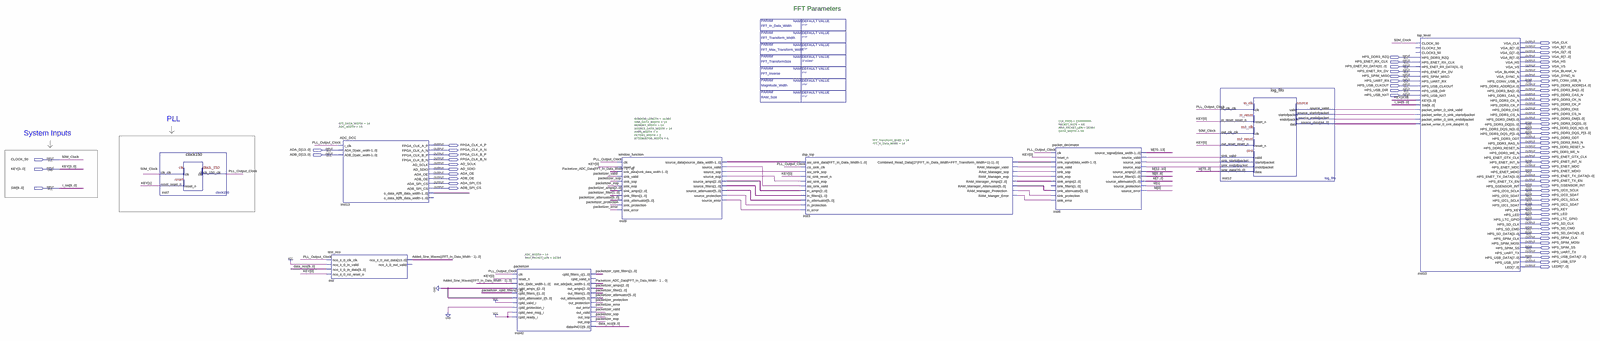
[diagram p0: schematic sheet, whole]
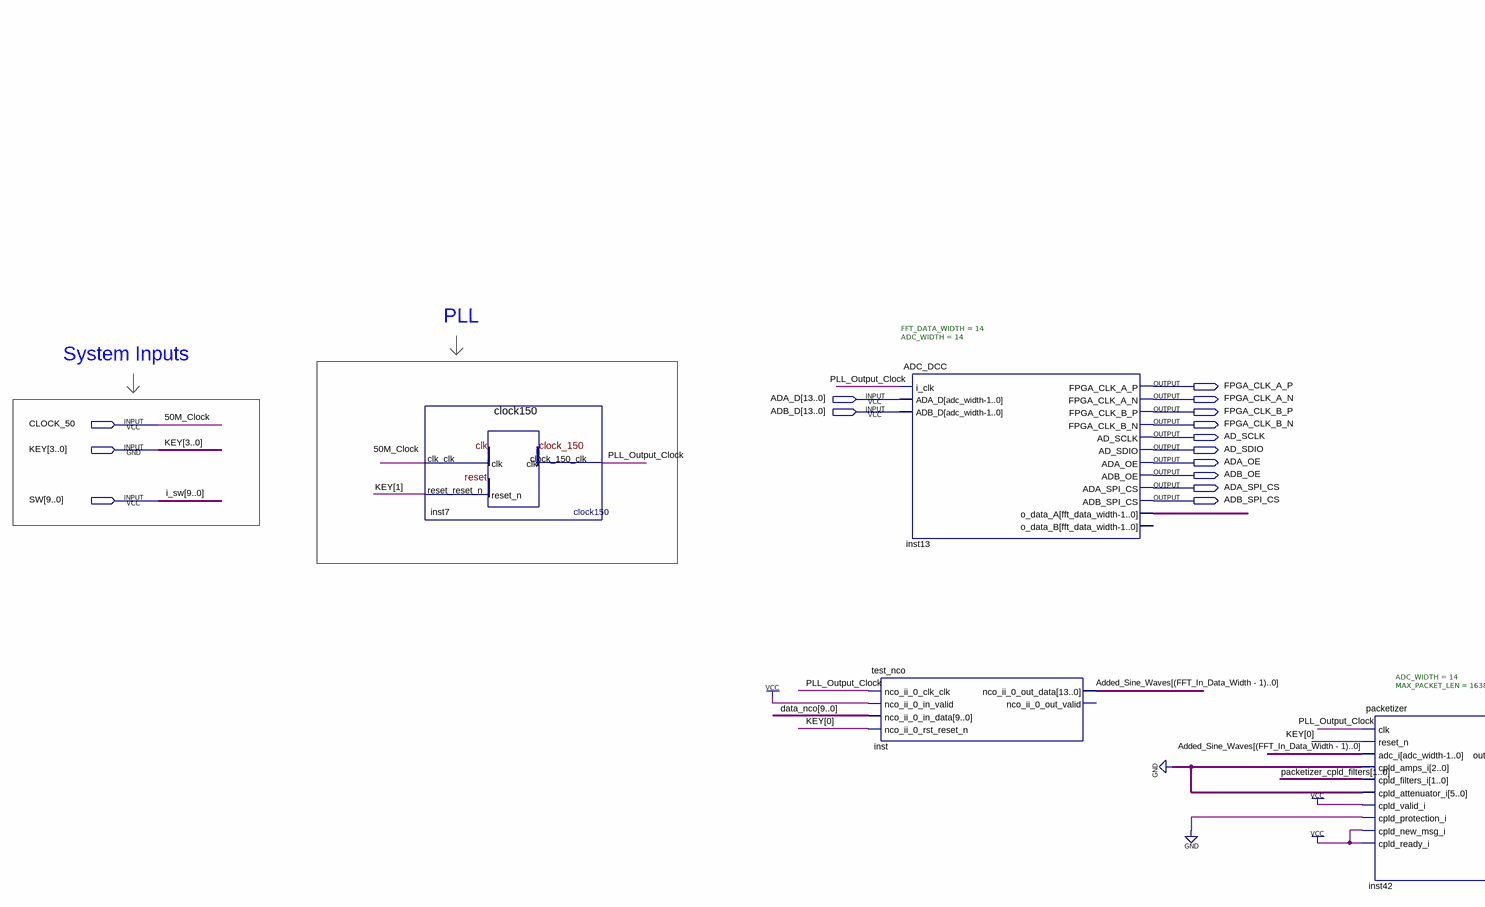
[diagram p1: schematic sheet, left part]
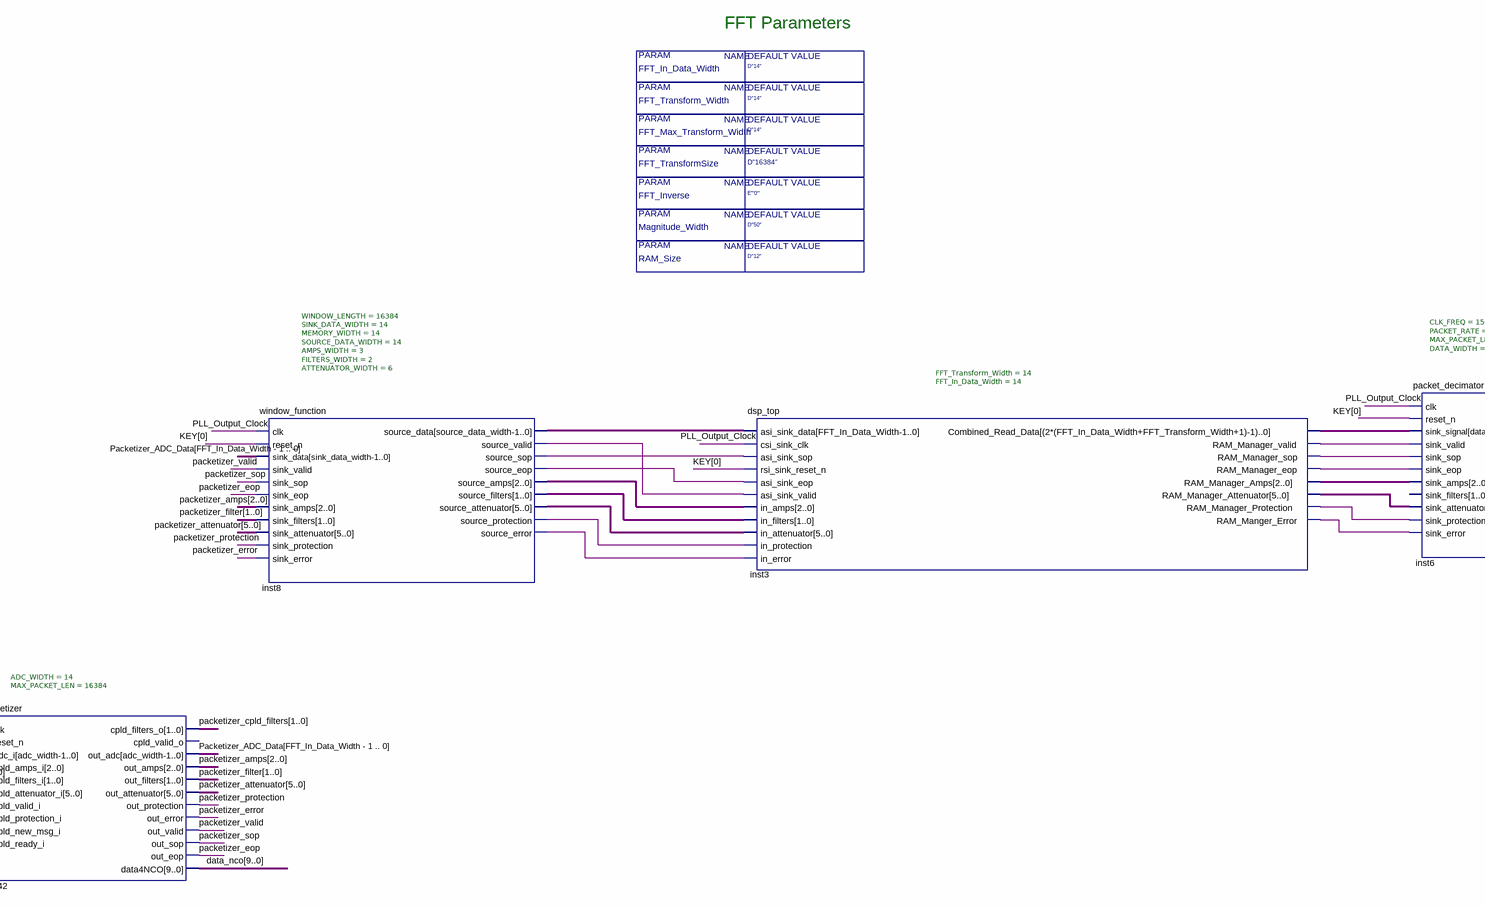
[diagram p2: schematic sheet, centre part]
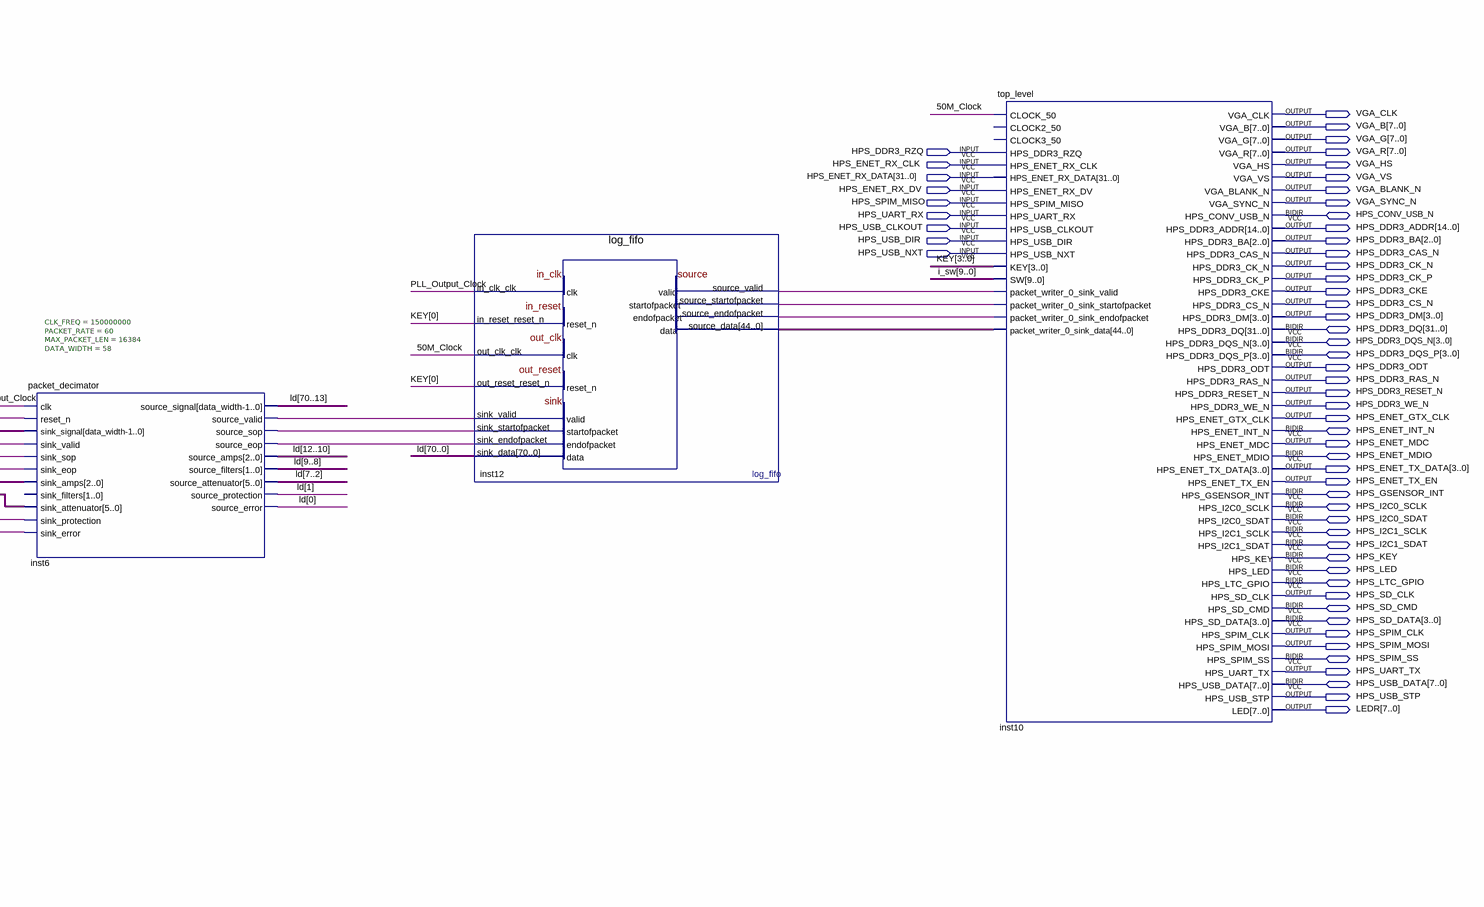
[diagram p3: schematic sheet, right part]
// Quartus schematic dsp_window.bdf as structural Verilog: 9 symbols, 72 pins
module dsp_window #(parameter FFT_Inverse = "E\"'0'\"", parameter RAM_Size = "D\"12\"", parameter FFT_In_Data_Width = "D\"14\"", parameter Magnitude_Width = "D\"50\"", parameter FFT_TransformSize = "D\"16384\"", parameter FFT_Transform_Width = "D\"14\"", parameter FFT_Max_Transform_Width = "D\"14\"") (
  input  HPS_DDR3_RZQ,
  input  HPS_ENET_RX_CLK,
  input  [31:0] HPS_ENET_RX_DATA,
  input  HPS_ENET_RX_DV,
  input  HPS_SPIM_MISO,
  input  HPS_UART_RX,
  input  HPS_USB_CLKOUT,
  input  HPS_USB_DIR,
  input  HPS_USB_NXT,
  input  [13:0] ADA_D,
  input  [13:0] ADB_D,
  input  CLOCK_50,
  input  [3:0] KEY,
  input  [9:0] SW,
  inout  HPS_CONV_USB_N,
  inout  [31:0] HPS_DDR3_DQ,
  inout  [3:0] HPS_DDR3_DQS_N,
  inout  [3:0] HPS_DDR3_DQS_P,
  inout  HPS_ENET_INT_N,
  inout  HPS_ENET_MDIO,
  inout  HPS_GSENSOR_INT,
  inout  HPS_I2C0_SCLK,
  inout  HPS_I2C0_SDAT,
  inout  HPS_I2C1_SCLK,
  inout  HPS_I2C1_SDAT,
  inout  HPS_KEY,
  inout  HPS_LED,
  inout  HPS_LTC_GPIO,
  inout  HPS_SD_CMD,
  inout  [3:0] HPS_SD_DATA,
  inout  HPS_SPIM_SS,
  inout  [7:0] HPS_USB_DATA,
  output VGA_CLK,
  output [7:0] VGA_B,
  output [7:0] VGA_G,
  output [7:0] VGA_R,
  output VGA_HS,
  output VGA_VS,
  output VGA_BLANK_N,
  output VGA_SYNC_N,
  output [14:0] HPS_DDR3_ADDR,
  output [2:0] HPS_DDR3_BA,
  output HPS_DDR3_CAS_N,
  output HPS_DDR3_CK_N,
  output HPS_DDR3_CK_P,
  output HPS_DDR3_CKE,
  output HPS_DDR3_CS_N,
  output [3:0] HPS_DDR3_DM,
  output HPS_DDR3_ODT,
  output HPS_DDR3_RAS_N,
  output FPGA_CLK_A_P,
  output HPS_DDR3_RESET_N,
  output FPGA_CLK_A_N,
  output HPS_DDR3_WE_N,
  output FPGA_CLK_B_P,
  output HPS_ENET_GTX_CLK,
  output FPGA_CLK_B_N,
  output AD_SCLK,
  output HPS_ENET_MDC,
  output AD_SDIO,
  output ADA_OE,
  output [3:0] HPS_ENET_TX_DATA,
  output ADB_OE,
  output HPS_ENET_TX_EN,
  output ADA_SPI_CS,
  output ADB_SPI_CS,
  output HPS_SD_CLK,
  output HPS_SPIM_CLK,
  output HPS_SPIM_MOSI,
  output HPS_UART_TX,
  output HPS_USB_STP,
  output [7:0] LEDR
);

  wire \Added_Sine_Waves[(FFT_In_Data_Width_-_1)..0] , inst3_ram_manager_eop, inst3_ram_manager_protection,
       inst3_ram_manager_sop, inst3_ram_manager_valid, inst3_ram_manger_error, inst6_source_eop,
       inst6_source_sop, inst6_source_valid, inst8_source_eop, inst8_source_error, inst8_source_protection,
       inst8_source_sop, inst8_source_valid, inst12_source_endofpacket, inst12_source_startofpacket,
       inst12_source_valid, \Packetizer_ADC_Data[FFT_In_Data_Width_-_1_.._0] , packetizer_eop,
       packetizer_error, packetizer_protection, packetizer_sop, packetizer_valid, PLL_Output_Clock;
  wire [1:0] inst8_source_filters, packetizer_cpld_filters, packetizer_filter;
  wire [2:0] inst3_ram_manager_amps, inst8_source_amps, packetizer_amps;
  wire [5:0] inst3_ram_manager_attenuator, inst8_source_attenuator, packetizer_attenuator;
  wire [9:0] data_nco;
  wire [13:0] inst8_source_data, inst13_o_data_a;
  wire [44:0] inst12_source_data;
  wire [57:0] inst3_combined_read_data;
  wire [70:0] ld;

  clock150 inst7 (.clk_clk(CLOCK_50), .reset_reset_n(KEY[1]), .clock_150_clk(PLL_Output_Clock));
  ADC_DCC #(.FFT_DATA_WIDTH(14), .ADC_WIDTH(14)) inst13 (
    .i_clk(PLL_Output_Clock), .ADA_D(ADA_D), .ADB_D(ADB_D), .FPGA_CLK_A_P(FPGA_CLK_A_P),
    .FPGA_CLK_A_N(FPGA_CLK_A_N), .FPGA_CLK_B_P(FPGA_CLK_B_P), .FPGA_CLK_B_N(FPGA_CLK_B_N), .AD_SCLK(AD_SCLK),
    .AD_SDIO(AD_SDIO), .ADA_OE(ADA_OE), .ADB_OE(ADB_OE), .ADA_SPI_CS(ADA_SPI_CS), .ADB_SPI_CS(ADB_SPI_CS),
    .o_data_A(inst13_o_data_a));  // open: o_data_B
  test_nco inst (
    .nco_ii_0_clk_clk(PLL_Output_Clock), .nco_ii_0_in_valid(1'b1), .nco_ii_0_in_data(data_nco),
    .nco_ii_0_rst_reset_n(KEY[0]), .nco_ii_0_out_data(\Added_Sine_Waves[(FFT_In_Data_Width_-_1)..0] ));  // open: nco_ii_0_out_valid
  packetizer #(.ADC_WIDTH(14), .MAX_PACKET_LEN(16384)) inst42 (
    .clk(PLL_Output_Clock), .reset_n(KEY[0]), .adc_i({14{\Added_Sine_Waves[(FFT_In_Data_Width_-_1)..0] }}),
    .cpld_amps_i({6{1'b0}}), .cpld_filters_i(packetizer_cpld_filters), .cpld_attenuator_i({6{1'b0}}),
    .cpld_valid_i(1'b1), .cpld_protection_i(1'b0), .cpld_new_msg_i(1'b1), .cpld_ready_i(1'b1),
    .cpld_filters_o(packetizer_cpld_filters), .out_adc(\Packetizer_ADC_Data[FFT_In_Data_Width_-_1_.._0] ),
    .out_amps(packetizer_amps), .out_filters(packetizer_filter), .out_attenuator(packetizer_attenuator),
    .out_protection(packetizer_protection), .out_error(packetizer_error), .out_valid(packetizer_valid),
    .out_sop(packetizer_sop), .out_eop(packetizer_eop), .data4NCO(data_nco));  // open: cpld_valid_o
  window_function #(.WINDOW_LENGTH(16384), .SINK_DATA_WIDTH(14), .MEMORY_WIDTH(14), .SOURCE_DATA_WIDTH(14), .AMPS_WIDTH(3), .FILTERS_WIDTH(2), .ATTENUATOR_WIDTH(6)) inst8 (
    .clk(PLL_Output_Clock), .reset_n(KEY[0]),
    .sink_data({14{\Packetizer_ADC_Data[FFT_In_Data_Width_-_1_.._0] }}), .sink_valid(packetizer_valid),
    .sink_sop(packetizer_sop), .sink_eop(packetizer_eop), .sink_amps(packetizer_amps),
    .sink_filters(packetizer_filter), .sink_attenuator(packetizer_attenuator),
    .sink_protection(packetizer_protection), .sink_error(packetizer_error), .source_data(inst8_source_data),
    .source_valid(inst8_source_valid), .source_sop(inst8_source_sop), .source_eop(inst8_source_eop),
    .source_amps(inst8_source_amps), .source_filters(inst8_source_filters),
    .source_attenuator(inst8_source_attenuator), .source_protection(inst8_source_protection),
    .source_error(inst8_source_error));
  dsp_top #(.FFT_Transform_Width(14), .FFT_In_Data_Width(14)) inst3 (
    .asi_sink_data(inst8_source_data), .csi_sink_clk(PLL_Output_Clock), .asi_sink_sop(inst8_source_sop),
    .rsi_sink_reset_n(KEY[0]), .asi_sink_eop(inst8_source_eop), .asi_sink_valid(inst8_source_valid),
    .in_amps(inst8_source_amps), .in_filters(inst8_source_filters), .in_attenuator(inst8_source_attenuator),
    .in_protection(inst8_source_protection), .in_error(inst8_source_error),
    .Combined_Read_Data(inst3_combined_read_data), .RAM_Manager_valid(inst3_ram_manager_valid),
    .RAM_Manager_sop(inst3_ram_manager_sop), .RAM_Manager_eop(inst3_ram_manager_eop),
    .RAM_Manager_Amps(inst3_ram_manager_amps), .RAM_Manager_Attenuator(inst3_ram_manager_attenuator),
    .RAM_Manager_Protection(inst3_ram_manager_protection), .RAM_Manger_Error(inst3_ram_manger_error));
  packet_decimator #(.CLK_FREQ(150000000), .PACKET_RATE(60), .MAX_PACKET_LEN(16384), .DATA_WIDTH(58)) inst6 (
    .clk(PLL_Output_Clock), .reset_n(KEY[0]), .sink_signal(inst3_combined_read_data),
    .sink_valid(inst3_ram_manager_valid), .sink_sop(inst3_ram_manager_sop), .sink_eop(inst3_ram_manager_eop),
    .sink_amps(inst3_ram_manager_amps), .sink_attenuator(inst3_ram_manager_attenuator),
    .sink_protection(inst3_ram_manager_protection), .sink_error(inst3_ram_manger_error),
    .source_signal(ld[70:13]), .source_valid(inst6_source_valid), .source_sop(inst6_source_sop),
    .source_eop(inst6_source_eop), .source_amps(ld[12:10]), .source_filters(ld[9:8]),
    .source_attenuator(ld[7:2]), .source_protection(ld[1]), .source_error(ld[0]));  // open: sink_filters
  log_fifo inst12 (
    .in_clk_clk(PLL_Output_Clock), .in_reset_reset_n(KEY[0]), .out_clk_clk(CLOCK_50),
    .out_reset_reset_n(KEY[0]), .sink_valid(inst6_source_valid), .sink_startofpacket(inst6_source_sop),
    .sink_endofpacket(inst6_source_eop), .sink_data(ld), .source_valid(inst12_source_valid),
    .source_startofpacket(inst12_source_startofpacket), .source_endofpacket(inst12_source_endofpacket),
    .source_data(inst12_source_data));
  top_level inst10 (
    .CLOCK_50(CLOCK_50), .HPS_DDR3_RZQ(HPS_DDR3_RZQ), .HPS_ENET_RX_CLK(HPS_ENET_RX_CLK),
    .HPS_ENET_RX_DATA(HPS_ENET_RX_DATA), .HPS_ENET_RX_DV(HPS_ENET_RX_DV), .HPS_SPIM_MISO(HPS_SPIM_MISO),
    .HPS_UART_RX(HPS_UART_RX), .HPS_USB_CLKOUT(HPS_USB_CLKOUT), .HPS_USB_DIR(HPS_USB_DIR),
    .HPS_USB_NXT(HPS_USB_NXT), .KEY(KEY), .SW(SW), .packet_writer_0_sink_valid(inst12_source_valid),
    .packet_writer_0_sink_startofpacket(inst12_source_startofpacket),
    .packet_writer_0_sink_endofpacket(inst12_source_endofpacket),
    .packet_writer_0_sink_data(inst12_source_data), .VGA_CLK(VGA_CLK), .VGA_B(VGA_B), .VGA_G(VGA_G),
    .VGA_R(VGA_R), .VGA_HS(VGA_HS), .VGA_VS(VGA_VS), .VGA_BLANK_N(VGA_BLANK_N), .VGA_SYNC_N(VGA_SYNC_N),
    .HPS_DDR3_ADDR(HPS_DDR3_ADDR), .HPS_DDR3_BA(HPS_DDR3_BA), .HPS_DDR3_CAS_N(HPS_DDR3_CAS_N),
    .HPS_DDR3_CK_N(HPS_DDR3_CK_N), .HPS_DDR3_CK_P(HPS_DDR3_CK_P), .HPS_DDR3_CKE(HPS_DDR3_CKE),
    .HPS_DDR3_CS_N(HPS_DDR3_CS_N), .HPS_DDR3_DM(HPS_DDR3_DM), .HPS_DDR3_ODT(HPS_DDR3_ODT),
    .HPS_DDR3_RAS_N(HPS_DDR3_RAS_N), .HPS_DDR3_RESET_N(HPS_DDR3_RESET_N), .HPS_DDR3_WE_N(HPS_DDR3_WE_N),
    .HPS_ENET_GTX_CLK(HPS_ENET_GTX_CLK), .HPS_ENET_MDC(HPS_ENET_MDC), .HPS_ENET_TX_DATA(HPS_ENET_TX_DATA),
    .HPS_ENET_TX_EN(HPS_ENET_TX_EN), .HPS_SD_CLK(HPS_SD_CLK), .HPS_SPIM_CLK(HPS_SPIM_CLK),
    .HPS_SPIM_MOSI(HPS_SPIM_MOSI), .HPS_UART_TX(HPS_UART_TX), .HPS_USB_STP(HPS_USB_STP), .LED(LEDR),
    .HPS_CONV_USB_N(HPS_CONV_USB_N), .HPS_DDR3_DQ(HPS_DDR3_DQ), .HPS_DDR3_DQS_N(HPS_DDR3_DQS_N),
    .HPS_DDR3_DQS_P(HPS_DDR3_DQS_P), .HPS_ENET_INT_N(HPS_ENET_INT_N), .HPS_ENET_MDIO(HPS_ENET_MDIO),
    .HPS_GSENSOR_INT(HPS_GSENSOR_INT), .HPS_I2C0_SCLK(HPS_I2C0_SCLK), .HPS_I2C0_SDAT(HPS_I2C0_SDAT),
    .HPS_I2C1_SCLK(HPS_I2C1_SCLK), .HPS_I2C1_SDAT(HPS_I2C1_SDAT), .HPS_KEY(HPS_KEY), .HPS_LED(HPS_LED),
    .HPS_LTC_GPIO(HPS_LTC_GPIO), .HPS_SD_CMD(HPS_SD_CMD), .HPS_SD_DATA(HPS_SD_DATA),
    .HPS_SPIM_SS(HPS_SPIM_SS), .HPS_USB_DATA(HPS_USB_DATA));  // open: CLOCK2_50, CLOCK3_50

  // Other names for the same wires on the sheet: 50M_Clock = CLOCK_50; i_sw[9:0] = SW

  // Notes on the sheet:
  //   FFT Parameters
  //   PLL
  //   System Inputs   
endmodule
